# EAGLE design v2 (EAGLE 8.3.1)
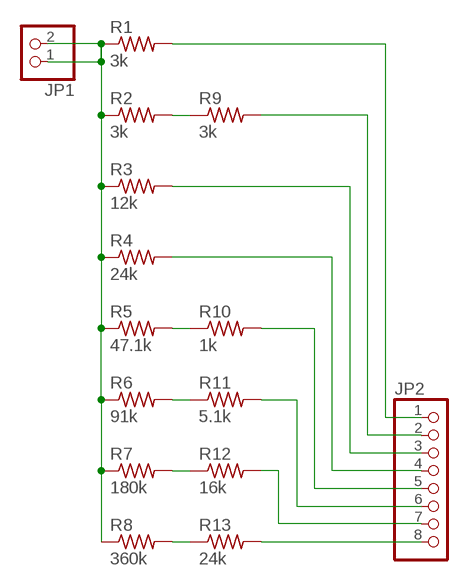
[diagram p0: schematic, sheet 1]

## Parts
JP1  PINHD-1X2  [1X02]
JP2  PINHD-1X8  [1X08]
R1  3k  R-US_0309/10  [0309/10]
R2  3k  R-US_0309/10  [0309/10]
R3  12k  R-US_0309/10  [0309/10]
R4  24k  R-US_0309/10  [0309/10]
R5  47.1k  R-US_0309/10  [0309/10]
R6  91k  R-US_0309/10  [0309/10]
R7  180k  R-US_0309/10  [0309/10]
R8  360k  R-US_0309/10  [0309/10]
R9  3k  R-US_0309/10  [0309/10]
R10  1k  R-US_0309/10  [0309/10]
R11  5.1k  R-US_0309/10  [0309/10]
R12  16k  R-US_0309/10  [0309/10]
R13  24k  R-US_0309/10  [0309/10]

## Nets
N$1: JP1.1 JP1.2 R1.1 R2.1 R3.1 R4.1 R5.1 R6.1 R7.1 R8.1
N$2: R7.2 R12.1
N$3: R8.2 R13.1
N$4: JP2.8 R13.2
N$5: R2.2 R9.1
N$6: R5.2 R10.1
N$7: R6.2 R11.1
N$8: JP2.1 R1.2
N$9: JP2.2 R9.2
N$10: JP2.3 R3.2
N$11: JP2.4 R4.2
N$12: JP2.5 R10.2
N$13: JP2.6 R11.2
N$14: JP2.7 R12.2

## Library data of the parts
JP1 = pinhead:PINHD-1X2: PIN HEADER
JP2 = pinhead:PINHD-1X8: PIN HEADER
R1-R13 = rcl:R-US_: RESISTOR, American symbol

## Board
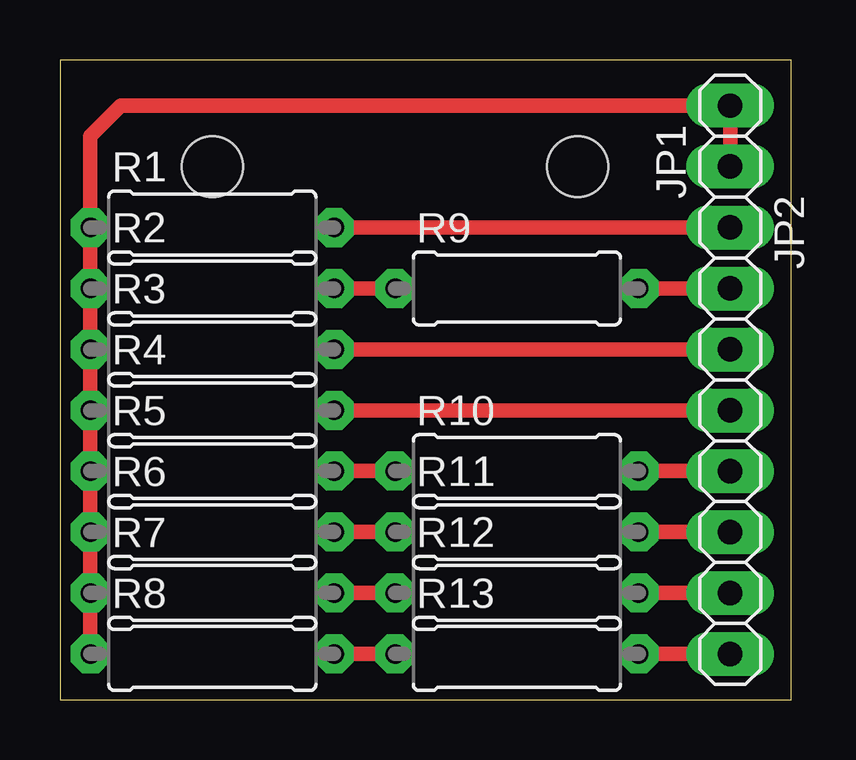
[diagram p1: board, top side]

Size 30.48 x 26.67 mm. Coordinates in mm from the lower left corner, seen from the top.
Outline: 0,0 30.48,0 30.48,26.67 0,26.67 0,0
Copper layers (1*16): Top 0.035mm / dielectric 1.5mm / Bottom 0.035mm
Design rules "default *": minimum track width 6mil, minimum drill 0.35mm, track to track 6mil, track to pad 6mil, pad to pad 6mil, via to via 6mil, smd to smd 6mil, copper to edge 40mil, drill to drill 6mil, minimum pad ring 16mil, minimum via ring 8mil, stop-mask expansion 4mil, vias tented up to drill 0mil, thermal gap 10mil
Holes 2.54 mm at 21.59,22.23 6.35,22.23

### Footprints (pad centres in the part's own frame; a part is rotated, then mirrored left to right if it is on the bottom)
1X02 = drill 1.016 long: 1 -1.27,0; 2 1.27,0
1X08 = drill 1.016 long: 1 -8.89,0; 2 -6.35,0; 3 -3.81,0; 4 -1.27,0; 5 1.27,0; 6 3.81,0; 7 6.35,0; 8 8.89,0
0309/10 = drill 0.813 octagon: 1 -5.08,0; 2 5.08,0

### Placement (x,y rotation side)
JP1  27.94,23.49 90 top
JP2  27.94,10.8 270 top
R1  6.35,19.69 0 top
R2  6.35,17.15 0 top
R3  6.35,14.61 0 top
R4  6.35,12.07 0 top
R5  6.35,9.53 0 top
R6  6.35,6.99 0 top
R7  6.35,4.45 0 top
R8  6.35,1.91 0 top
R9  19.05,17.15 0 top
R10  19.05,9.53 0 top
R11  19.05,6.99 0 top
R12  19.05,4.45 0 top
R13  19.05,1.91 0 top

### Tracks (layer width: path | path; a pad name or v marks a point on that pad's centre or on a via)
N$1
  Top 0.61: R8.1 R7.1 R6.1 R5.1 R4.1 R3.1 R2.1 R1.1 1.27,23.49 2.54,24.77 JP1.2 JP1.1
N$2
  Top 0.61: R12.1 R7.2
N$3
  Top 0.61: R13.1 R8.2
N$4
  Top 0.61: JP2.8 R13.2
N$5
  Top 0.61: R9.1 R2.2
N$6
  Top 0.61: R10.1 R5.2
N$7
  Top 0.61: R6.2 R11.1
N$8
  Top 0.61: JP2.1 R1.2
N$9
  Top 0.61: R9.2 JP2.2
N$10
  Top 0.61: 26.67,14.61 JP2.3 R3.2
N$11
  Top 0.61: JP2.4 R4.2
N$12
  Top 0.61: JP2.5 R10.2
N$13
  Top 0.61: R11.2 JP2.6
N$14
  Top 0.61: JP2.7 R12.2